# EAGLE schematic Microduino-Motion (EAGLE 6.4)
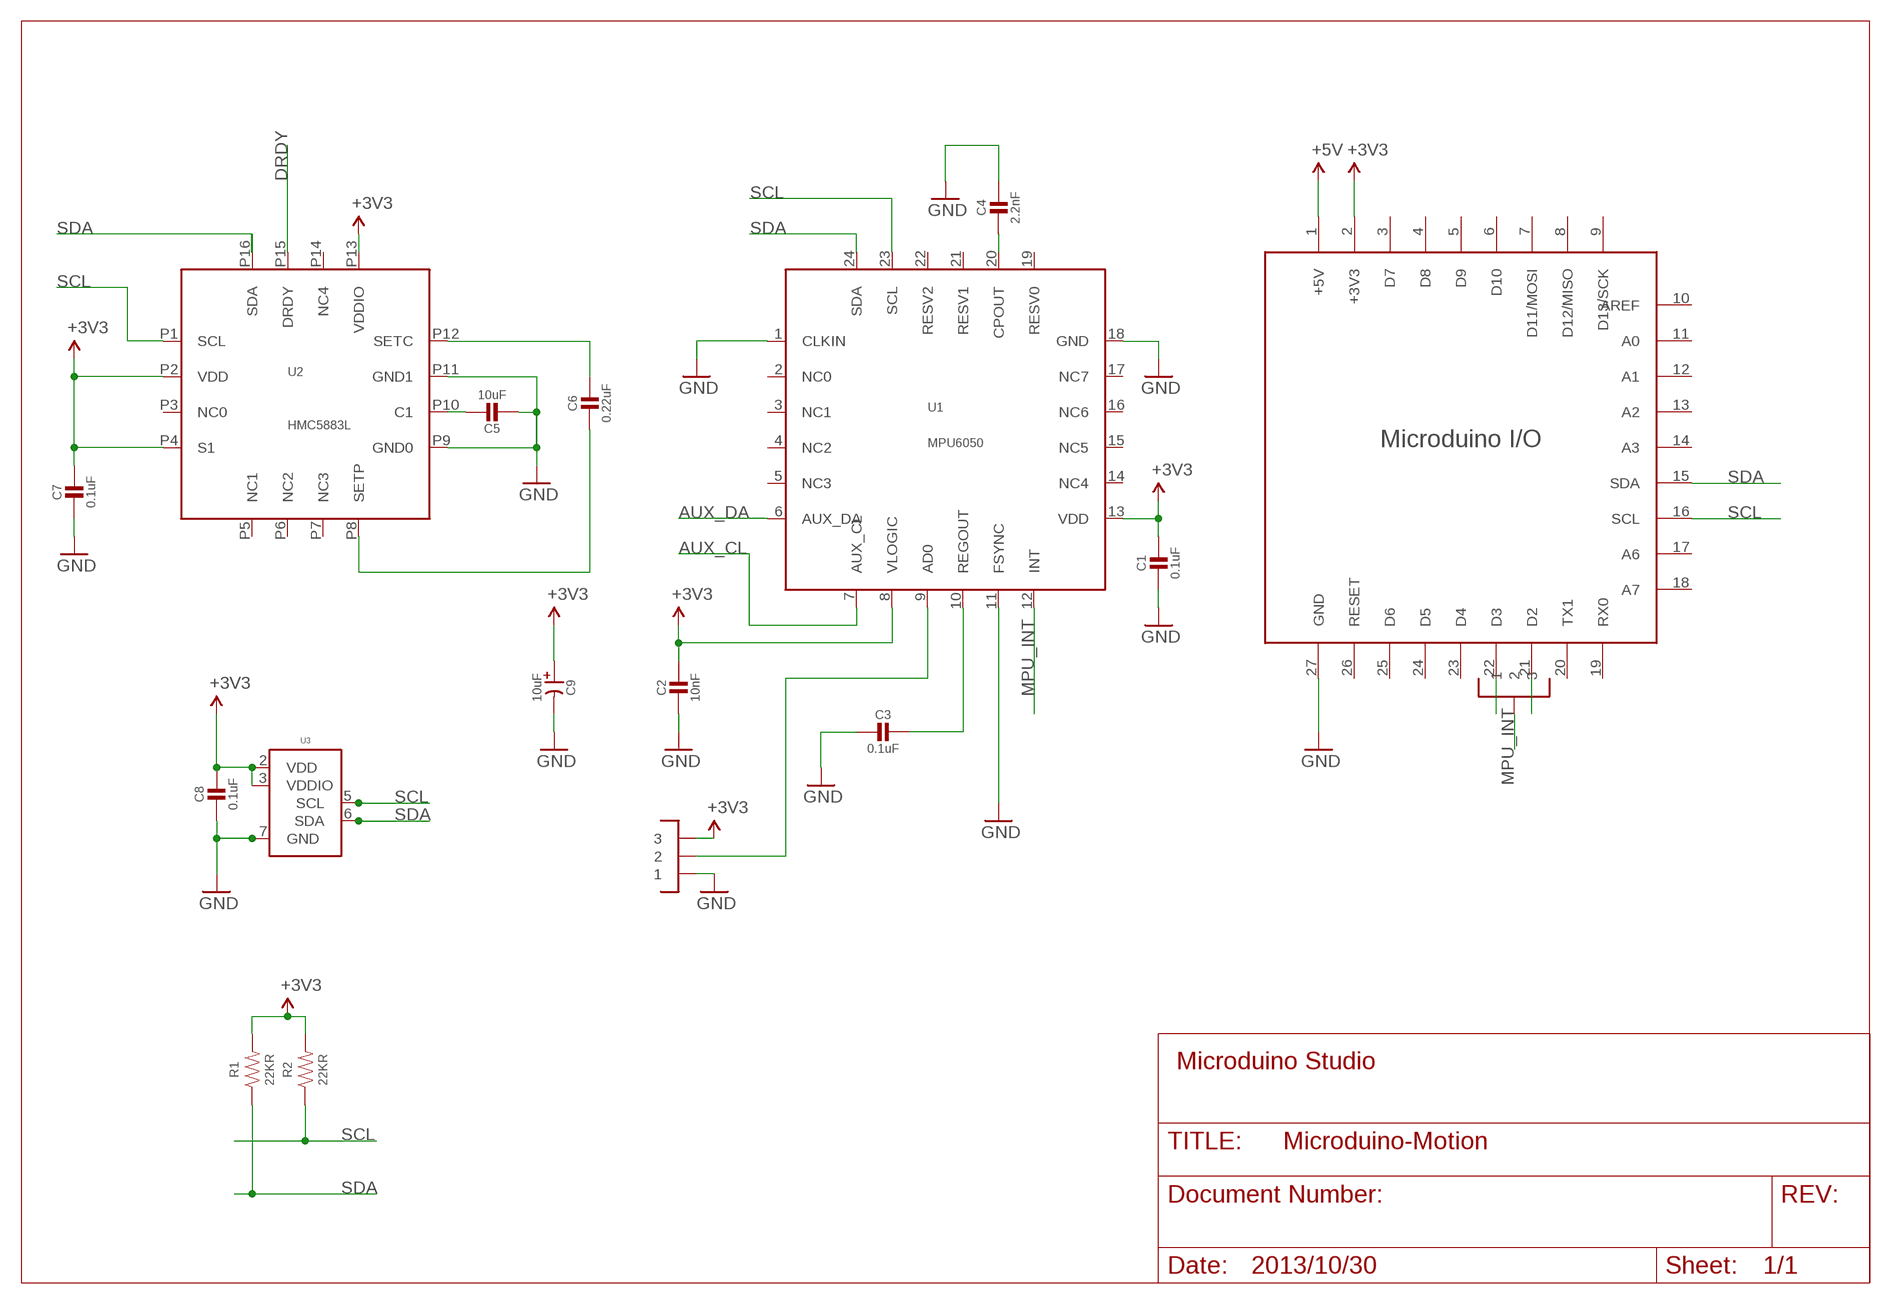
[diagram p0: schematic, sheet 1]

## Parts
AD0  NULL  JUMPER1-2  [JUMPER1-2]
C1  0.1uF  CAP0603  [0603-CAP]
C2  10nF  CAP0603  [0603-CAP]
C3  0.1uF  CAP0603  [0603-CAP]
C4  2.2nF  CAP0603  [0603-CAP]
C5  10uF  CAP0805  [0805-CAP]
C6  0.22uF  CAP0603  [0603-CAP]
C7  0.1uF  CAP0603  [0603-CAP]
C8  0.1uF  CAP0603  [0603-CAP]
C9  10uF  CAP_POL3528  [CAP-3528]
INT  JUMPER1-2  [JUMPER1-2]
R1  22KR  RES0603  [0603-RES]
R2  22KR  RES0603  [0603-RES]
U1  MPU6050  [QFN24-4X4]
U2  HMC5883L  [LPCC16]
U3  BMP-180  BMP180  [BMP180]
U$3  MICRDUINO-PINNORMAL  [27UPIN-NORMAL]

## Nets
+3V3: AD0.3 C1.1 C2.1 C7.1 C8.1 C9.A(+) R1.2 R2.2 U1.8(VLOGIC) U1.13(VDD) U2.P2(VDD) U2.P4(S1) U2.P13(VDDIO) U3.2(VDD) U3.3(VDDIO) U$3.2(+3V3)
+5V: U$3.1(+5V)
AUX_CL: U1.7(AUX_CL)
AUX_DA: U1.6(AUX_DA)
DRDY: U2.P15(DRDY)
GND: AD0.1 C1.2 C2.2 C3.2 C4.1 C5.2 C7.2 C8.2 C9.C(-) U1.1(CLKIN) U1.11(FSYNC) U1.18(GND) U2.P9(GND0) U2.P11(GND1) U3.7(GND) U$3.27(GND)
MPU_INT: INT.2 U1.12(INT)
N$1: INT.1 U$3.22(D3)
N$3: INT.3 U$3.21(D2)
N$4: AD0.2 U1.9(AD0)
N$5: C3.1 U1.10(REGOUT)
N$8: C4.2 U1.20(CPOUT)
N$10: C6.2 U2.P8(SETP)
N$12: C6.1 U2.P12(SETC)
N$13: C5.1 U2.P10(C1)
SCL: R2.1 U1.23(SCL) U2.P1(SCL) U3.5(SCL) U$3.16(SCL)
SDA: R1.1 U1.24(SDA) U2.P16(SDA) U3.6(SDA) U$3.15(SDA)
Unconnected: U1.2(NC0) U1.3(NC1) U1.4(NC2) U1.5(NC3) U1.14(NC4) U1.15(NC5) U1.16(NC6) U1.17(NC7) U1.19(RESV0) U1.21(RESV1) U1.22(RESV2) U2.P3(NC0) U2.P5(NC1) U2.P6(NC2) U2.P7(NC3) U2.P14(NC4) U$3.3(D7) U$3.4(D8) U$3.5(D9) U$3.6(D10) U$3.7(D11/MOSI) U$3.8(D12/MISO) U$3.9(D13/SCK) U$3.10(AREF) U$3.11(A0) U$3.12(A1) U$3.13(A2) U$3.14(A3) U$3.17(A6) U$3.18(A7) U$3.19(RX0) U$3.20(TX1) U$3.23(D4) U$3.24(D5) U$3.25(D6) U$3.26(RESET)

## Notes on the sheet
- Microduino Studio
- 2013/10/30

## Library data of the parts
AD0 = microduino:JUMPER1-2
C1-C8 = #_Microduino:CAP: Capacitor Standard 0603 ceramic capacitor, and 0.1" leaded capacitor.
C9 = #_Microduino:CAP_POL: Capacitor Polarized These are standard SMD and PTH capacitors. Normally 10uF, 47uF, and 100uF in electrolytic and tantalum varieties. Always verify the external diameter of the through hole cap, it varies with capacity, voltage, and manufacturer. The EIA devices should be standard.
INT = #_Microduino:JUMPER1-2
R1 R2 = #_Microduino:RES: Resistor Basic schematic elements and footprints for 0603, 1206, and PTH 1/10th watt (small) resistors.
U1 = microduino:MPU6050
U2 = microduino:HMC5883L
U3 = #_Microduino:BMP180
U$3 = #_Microduino:MICRDUINO-PIN: microduino引脚封装

## Net classes
0 default: width 0.203 mm, drill 0.381 mm, clearance 0.254 mm
1 power: width 0.254 mm, drill 0.381 mm, clearance 0.254 mm
2 gnd: width 0.254 mm, drill 0.381 mm, clearance 0.254 mm
3 usbvcc: width 0.254 mm, drill 0.381 mm, clearance 0.254 mm